# EasyEDA Pro project VS_Module.eprj

# Schematic Schematic1
Board Name: Board1; Create Date: 2025-07-11; Page Name: P1; Project Name: VS_Module; Schematic Name: Schematic1; Update Date: 2025-07-11; Company: EasyEDA.com; Page Size: A4; Version: V1.0
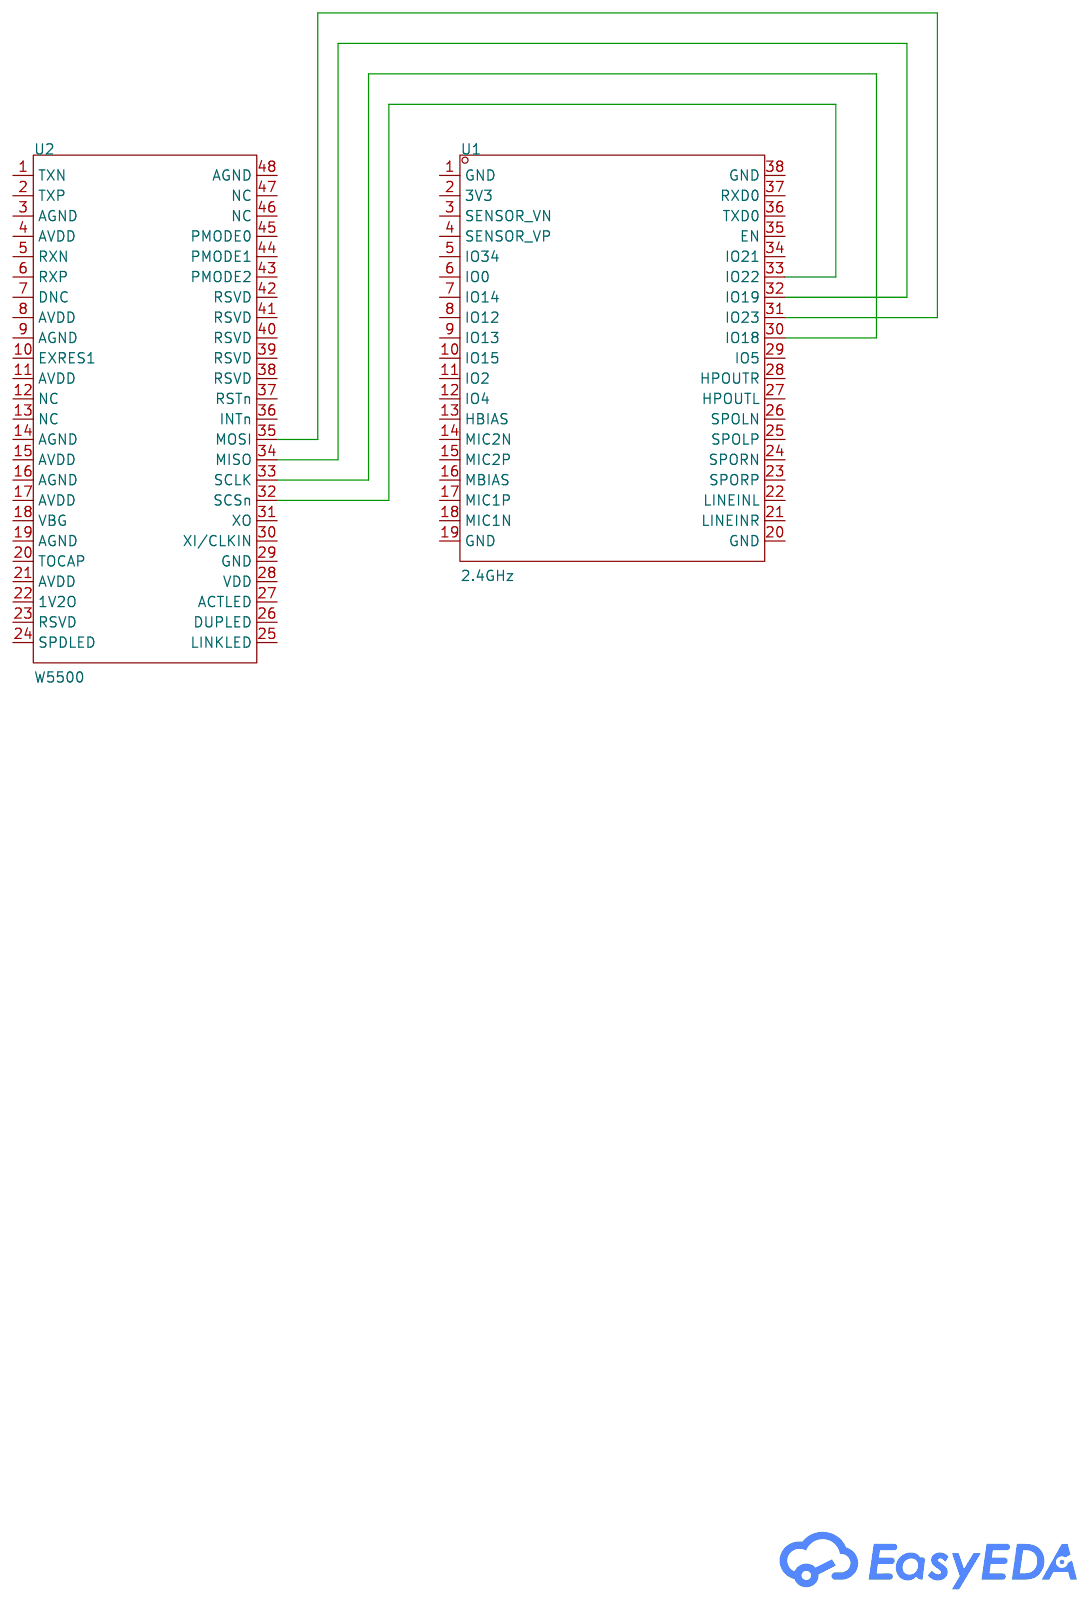
[diagram p0: schematic sheet]

## Parts
U1  2.4GHz  [WIRELM-SMD_ESP32-A1S]
U2  W5500  [LQFP-48_L7.0-W7.0-P0.50-LS9.0-BL]

## Library data of the parts
U1 = ESP32-A1S: Supplier Part: C277945; Manufacturer: Ai-Thinker(安信可); Supplier Footprint: SMD; JLCPCB Part Class: Extended Part; Datasheet: https://atta.szlcsc.com/upload/public/pdf/source/20180906/C277945_BA6E60AE72FED9B0FE943D6A3C9ACDD7.pdf; Supplier: LCSC; Core Processor: ESP32芯片; Output Power: 17dBm; Operating Voltage: 3.3V; Sensitivity: -90dBm; Operating Temperature: -20℃~+85℃
U2 = W5500: LCSC Part Name: W5500硬连线TCP/IP嵌入式以太网控制器; Supplier Part: C32843; Manufacturer: WIZNET; Supplier Footprint: LQFP-48(7x7); JLCPCB Part Class: Extended Part; Datasheet: https://atta.szlcsc.com/upload/public/pdf/source/20230714/E10C32B058E0BA54FCE1C1556BE10C07.pdf; Supplier: LCSC; Number of Channels: 8; Interface: SPI; Voltage - Supply: 3.3V; Current - Supply: 132mA; Operating Temperature: -40℃~+85℃

## Nets
Net-(U1-30): U1.30(IO18) U2.33(SCLK)
Net-(U1-31): U1.31(IO23) U2.35(MOSI)
Net-(U1-32): U1.32(IO19) U2.34(MISO)
Net-(U1-33): U1.33(IO22) U2.32(SCSn)

Not connected (* = marked no-connect by the designer): U1 1(GND) 2(3V3) 3(SENSOR_VN) 4(SENSOR_VP) 5(IO34) 6(IO0) 7(IO14) 8(IO12) 9(IO13) 10(IO15) 11(IO2) 12(IO4) 13(HBIAS) 14(MIC2N) 15(MIC2P) 16(MBIAS) 17(MIC1P) 18(MIC1N) 19(GND) 20(GND) 21(LINEINR) 22(LINEINL) 23(SPORP) 24(SPORN) 25(SPOLP) 26(SPOLN) 27(HPOUTL) 28(HPOUTR) 29(IO5) 34(IO21) 35(EN) 36(TXD0) 37(RXD0) 38(GND); U2 1(TXN) 2(TXP) 3(AGND) 4(AVDD) 5(RXN) 6(RXP) 7(DNC) 8(AVDD) 9(AGND) 10(EXRES1) 11(AVDD) 12(NC) 13(NC) 14(AGND) 15(AVDD) 16(AGND) 17(AVDD) 18(VBG) 19(AGND) 20(TOCAP) 21(AVDD) 22(1V2O) 23(RSVD) 24(SPDLED) 25(LINKLED) 26(DUPLED) 27(ACTLED) 28(VDD) 29(GND) 30(XI/CLKIN) 31(XO) 36(INTn) 37(RSTn) 38(RSVD) 39(RSVD) 40(RSVD) 41(RSVD) 42(RSVD) 43(PMODE2) 44(PMODE1) 45(PMODE0) 46(NC) 47(NC) 48(AGND)

# Board PCB1
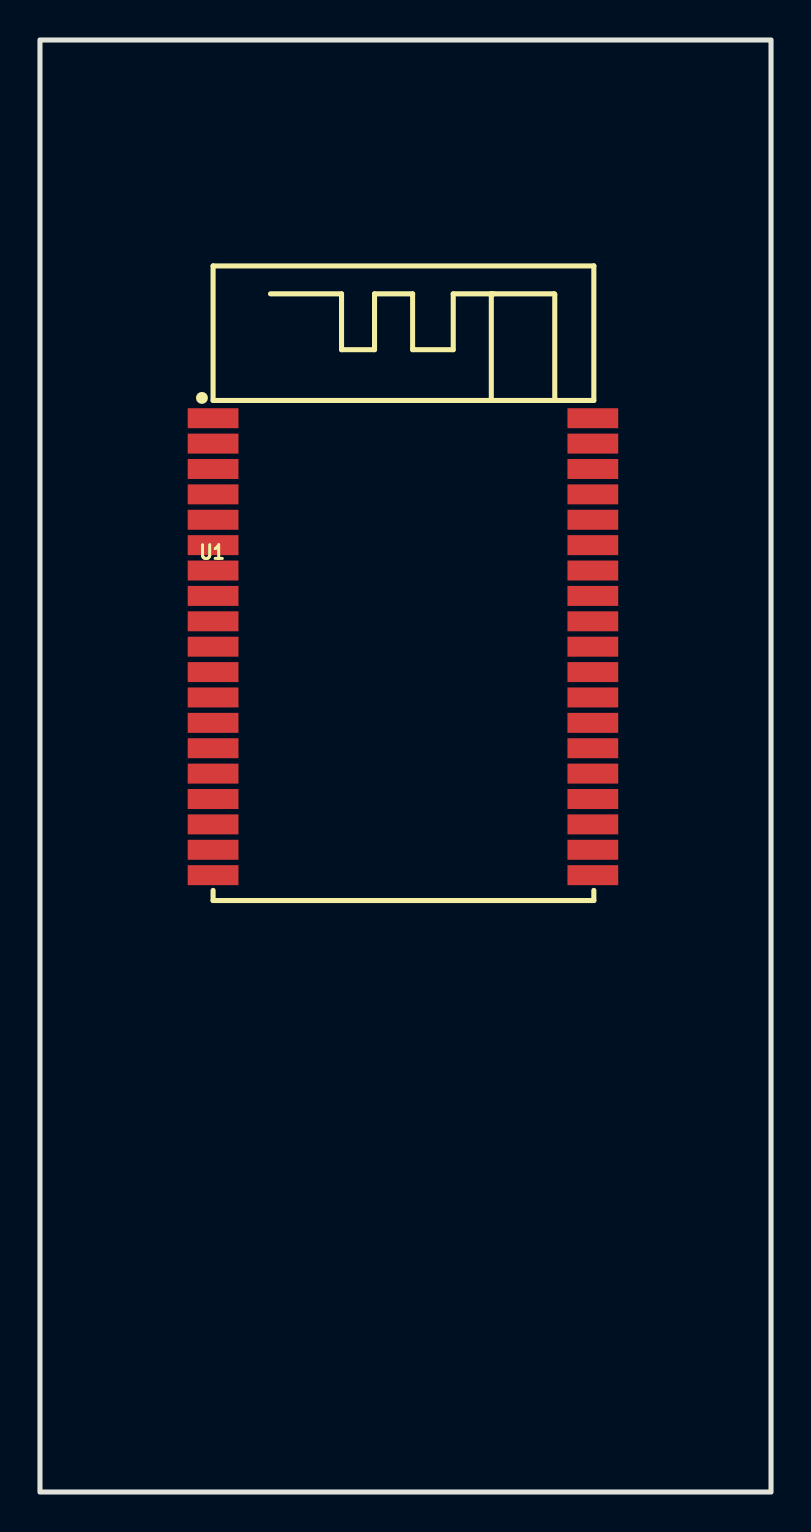
[diagram p1: board, top side]
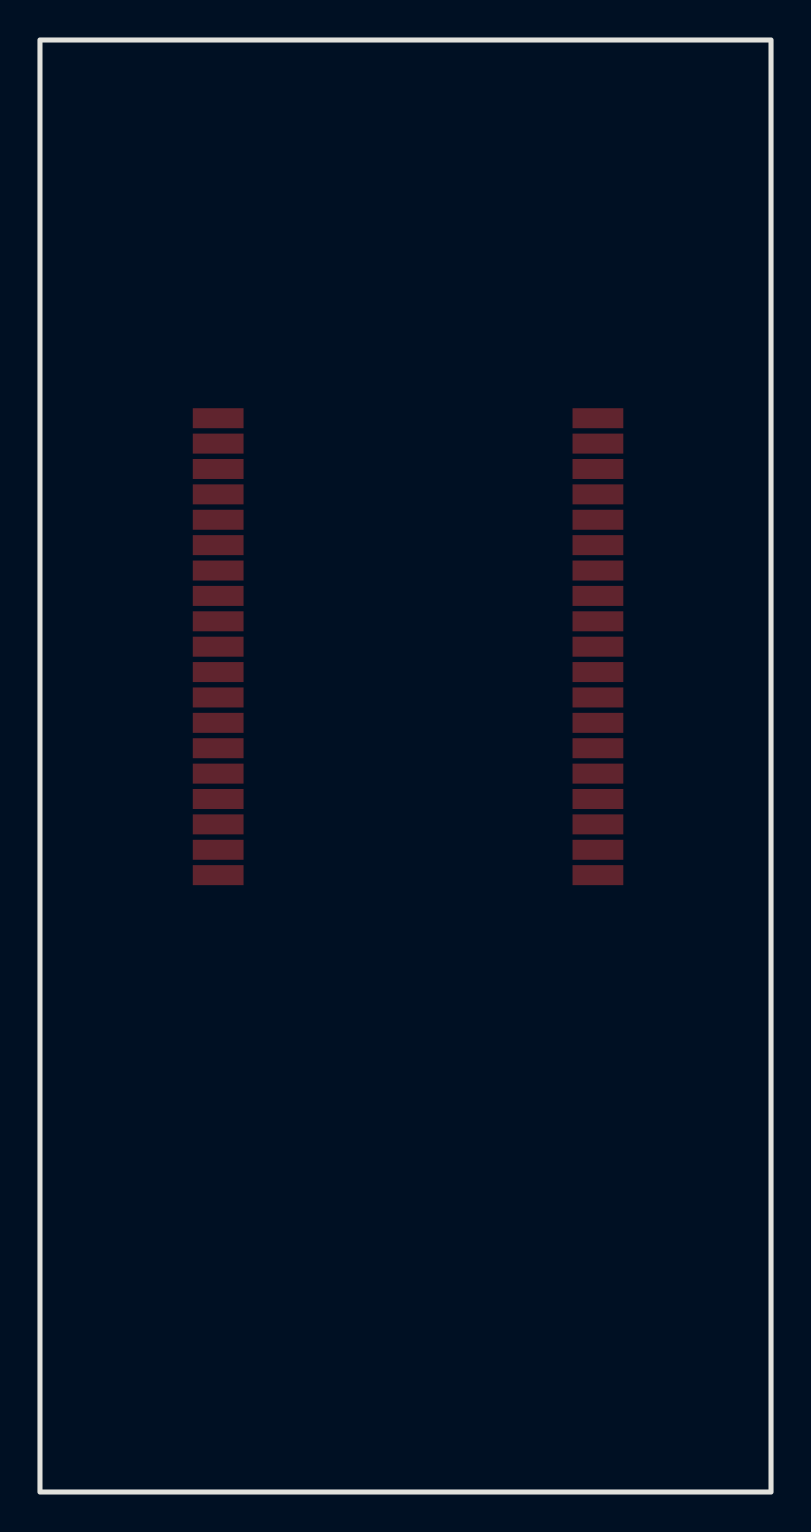
[diagram p2: board, bottom side, seen from below]

Outline 36.58 x 72.64 mm; copper layers: Top Layer, Bottom Layer. Coordinates in mm from the lower left corner of the outline.
Outline path: rectangle 0,72.64 36.58,0
Stack: Top Layer 0.035mm / Dielectric1 1.51mm FR4 er 4.5 / Bottom Layer 0.035mm

## Design rules (mm)
template: JLCPCB Capability(Two Layers Board)
spacing copperThickness1oz (default): track to track 0.102, other pairs 0.152 to 0.3
spacing copperThickness2oz: track to track 0.203, other pairs 0.152 to 0.3
track width copperThickness1oz (default): min 0.127, default 0.254, max 2.54
track width copperThickness2oz: min 0.203, default 0.254, max 2.54
differential pair differentialPair (default): width min 0.127, default 0.254, max 2.54; gap min 0.152, default 0.152
via viaSize (default): diameter min 0.5, default 0.61, max 10; hole min 0.3, default 0.305, max 6.3

## Placement (name value [footprint] x y rotation side)
U1  2.4GHz  [WIRELM-SMD_ESP32-A1S]  18.16 42.29 0 top

## Footprints (pads in the part's own frame, mm; a bottom-side part is the same pattern mirrored in y, then rotated)
WIRELM-SMD_ESP32-A1S
  rect 2.54x1 smd: 1(-9.5,11.43) 2(-9.5,10.16) 3(-9.5,8.89) 4(-9.5,7.62) 5(-9.5,6.35) 6(-9.5,5.08) 7(-9.5,3.81) 8(-9.5,2.54) 9(-9.5,1.27) 10(-9.5,0) 11(-9.5,-1.27) 12(-9.5,-2.54) 13(-9.5,-3.81) 14(-9.5,-5.08) 15(-9.5,-6.35) 16(-9.5,-7.62) 17(-9.5,-8.89) 18(-9.5,-10.16) 19(-9.5,-11.43) 20(9.5,-11.43) 21(9.5,-10.16) 22(9.5,-8.89) 23(9.5,-7.62) 24(9.5,-6.35) 25(9.5,-5.08) 26(9.5,-3.81) 27(9.5,-2.54) 28(9.5,-1.27) 29(9.5,0) 30(9.5,1.27) 31(9.5,2.54) 32(9.5,3.81) 33(9.5,5.08) 34(9.5,6.35) 35(9.5,7.62) 36(9.5,8.89) 37(9.5,10.16) 38(9.5,11.43)

## Nets
As in the schematic.

Pads without a net: U1 1 2 3 4 5 6 7 8 9 10 11 12 13 14 15 16 17 18 19 20 21 22 23 24 25 26 27 28 29 30 31 32 33 34 35 36 37 38
